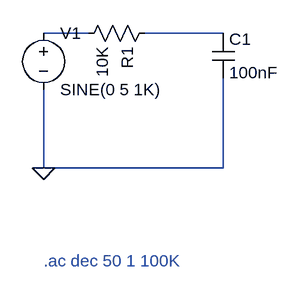
[diagram p0: schematic rc-filter.asc]
rc-filter.asc, the LTspice schematic file:
Version 4
SHEET 1 880 680
WIRE 192 96 256 96
WIRE 336 96 448 96
WIRE 192 176 192 288
WIRE 448 160 448 288
WIRE 192 288 448 288
SYMBOL voltage 192 80 R0
SYMATTR InstName V1
SYMATTR Value SINE(0 5 1K)
SYMBOL res 352 80 R90
SYMATTR InstName R1
SYMATTR Value 10K
SYMBOL cap 432 96 R0
SYMATTR InstName C1
SYMATTR Value 100nF
FLAG 192 288 0
TEXT 192 420 Left 2 .ac dec 50 1 100K

The netlist it stands for:
* rc-filter.asc
V1 N001 0 SINE(0 5 1K)
R1 N002 N001 10K
C1 N002 0 100nF
* .ac dec 50 1 100K
.backanno
.end